# EasyEDA Pro project design.epro, schematic testing_stage1_schematic

## Sheets
1 microcontroller: Board Name: testing_stage1; Create Date: 2025-03-28; Page Name: microcontroller; Project Name: macropad-final; Schematic Name: testing_stage1_schematic; Update Date: 2025-04-02; Company: EasyEDA.com; Page Size: A4; Version: V1.0
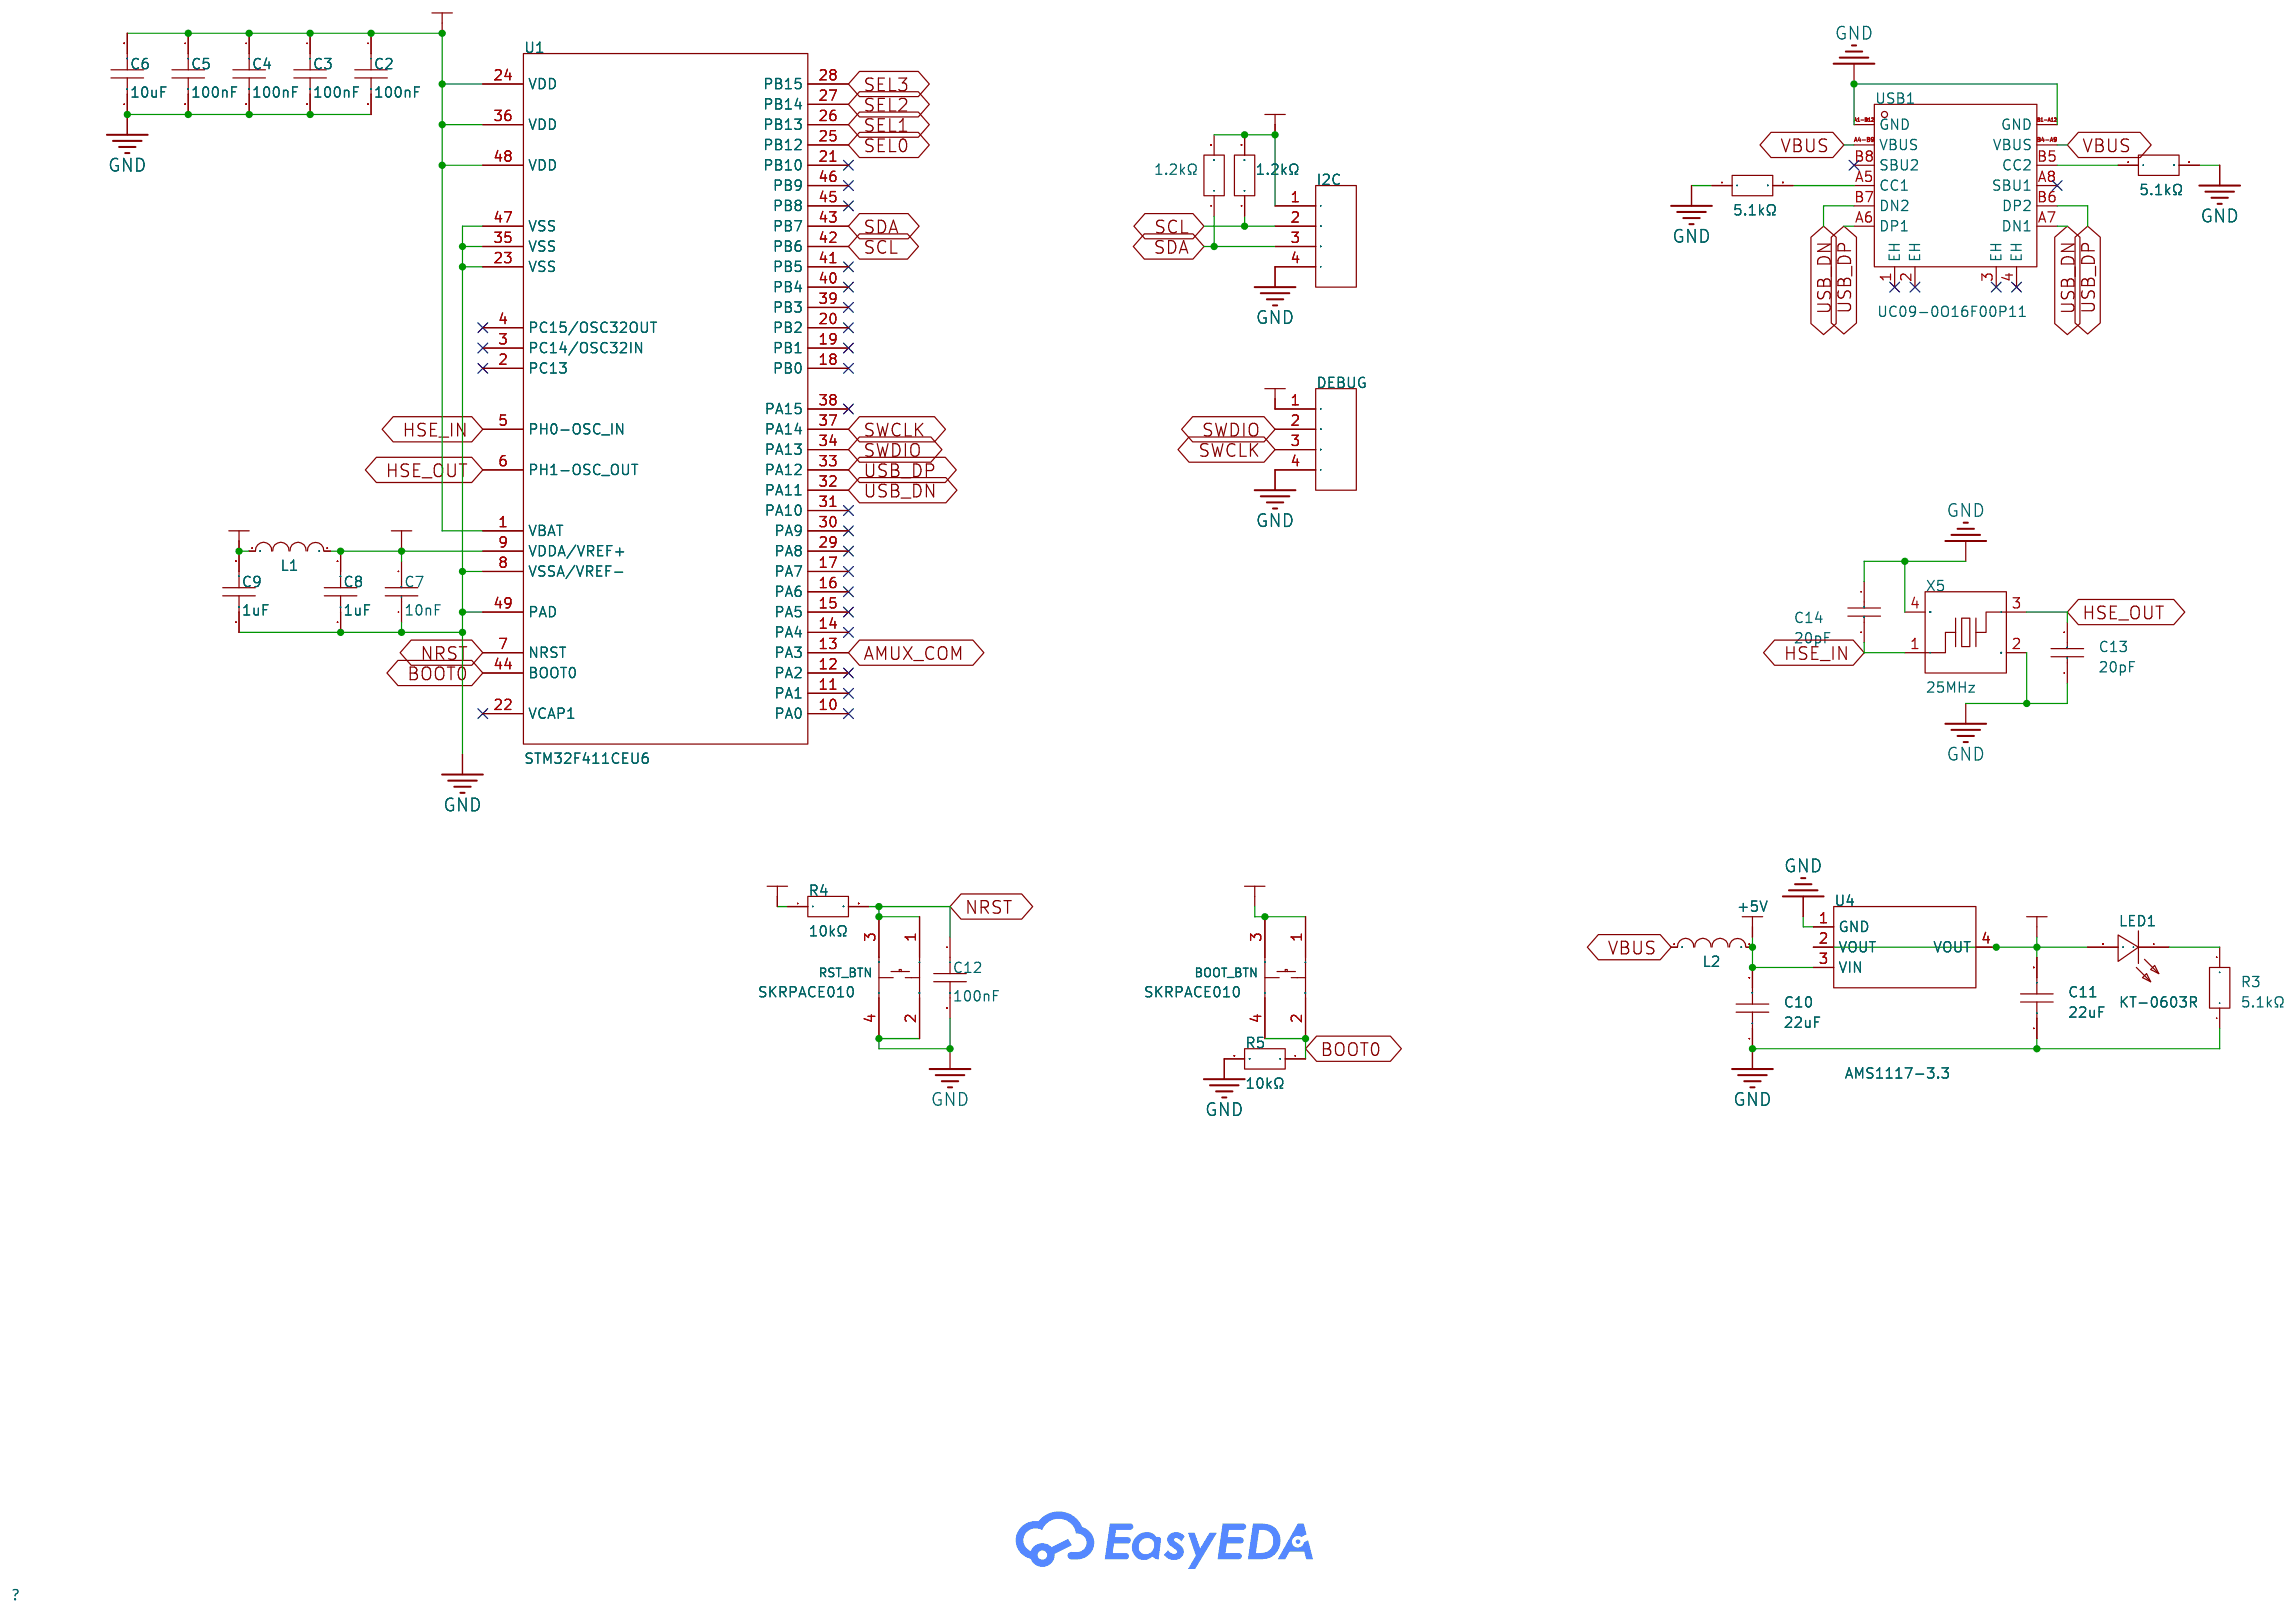
[diagram p9: microcontroller]
2 buttons: Page Name: buttons; Update Date: 2025-03-29
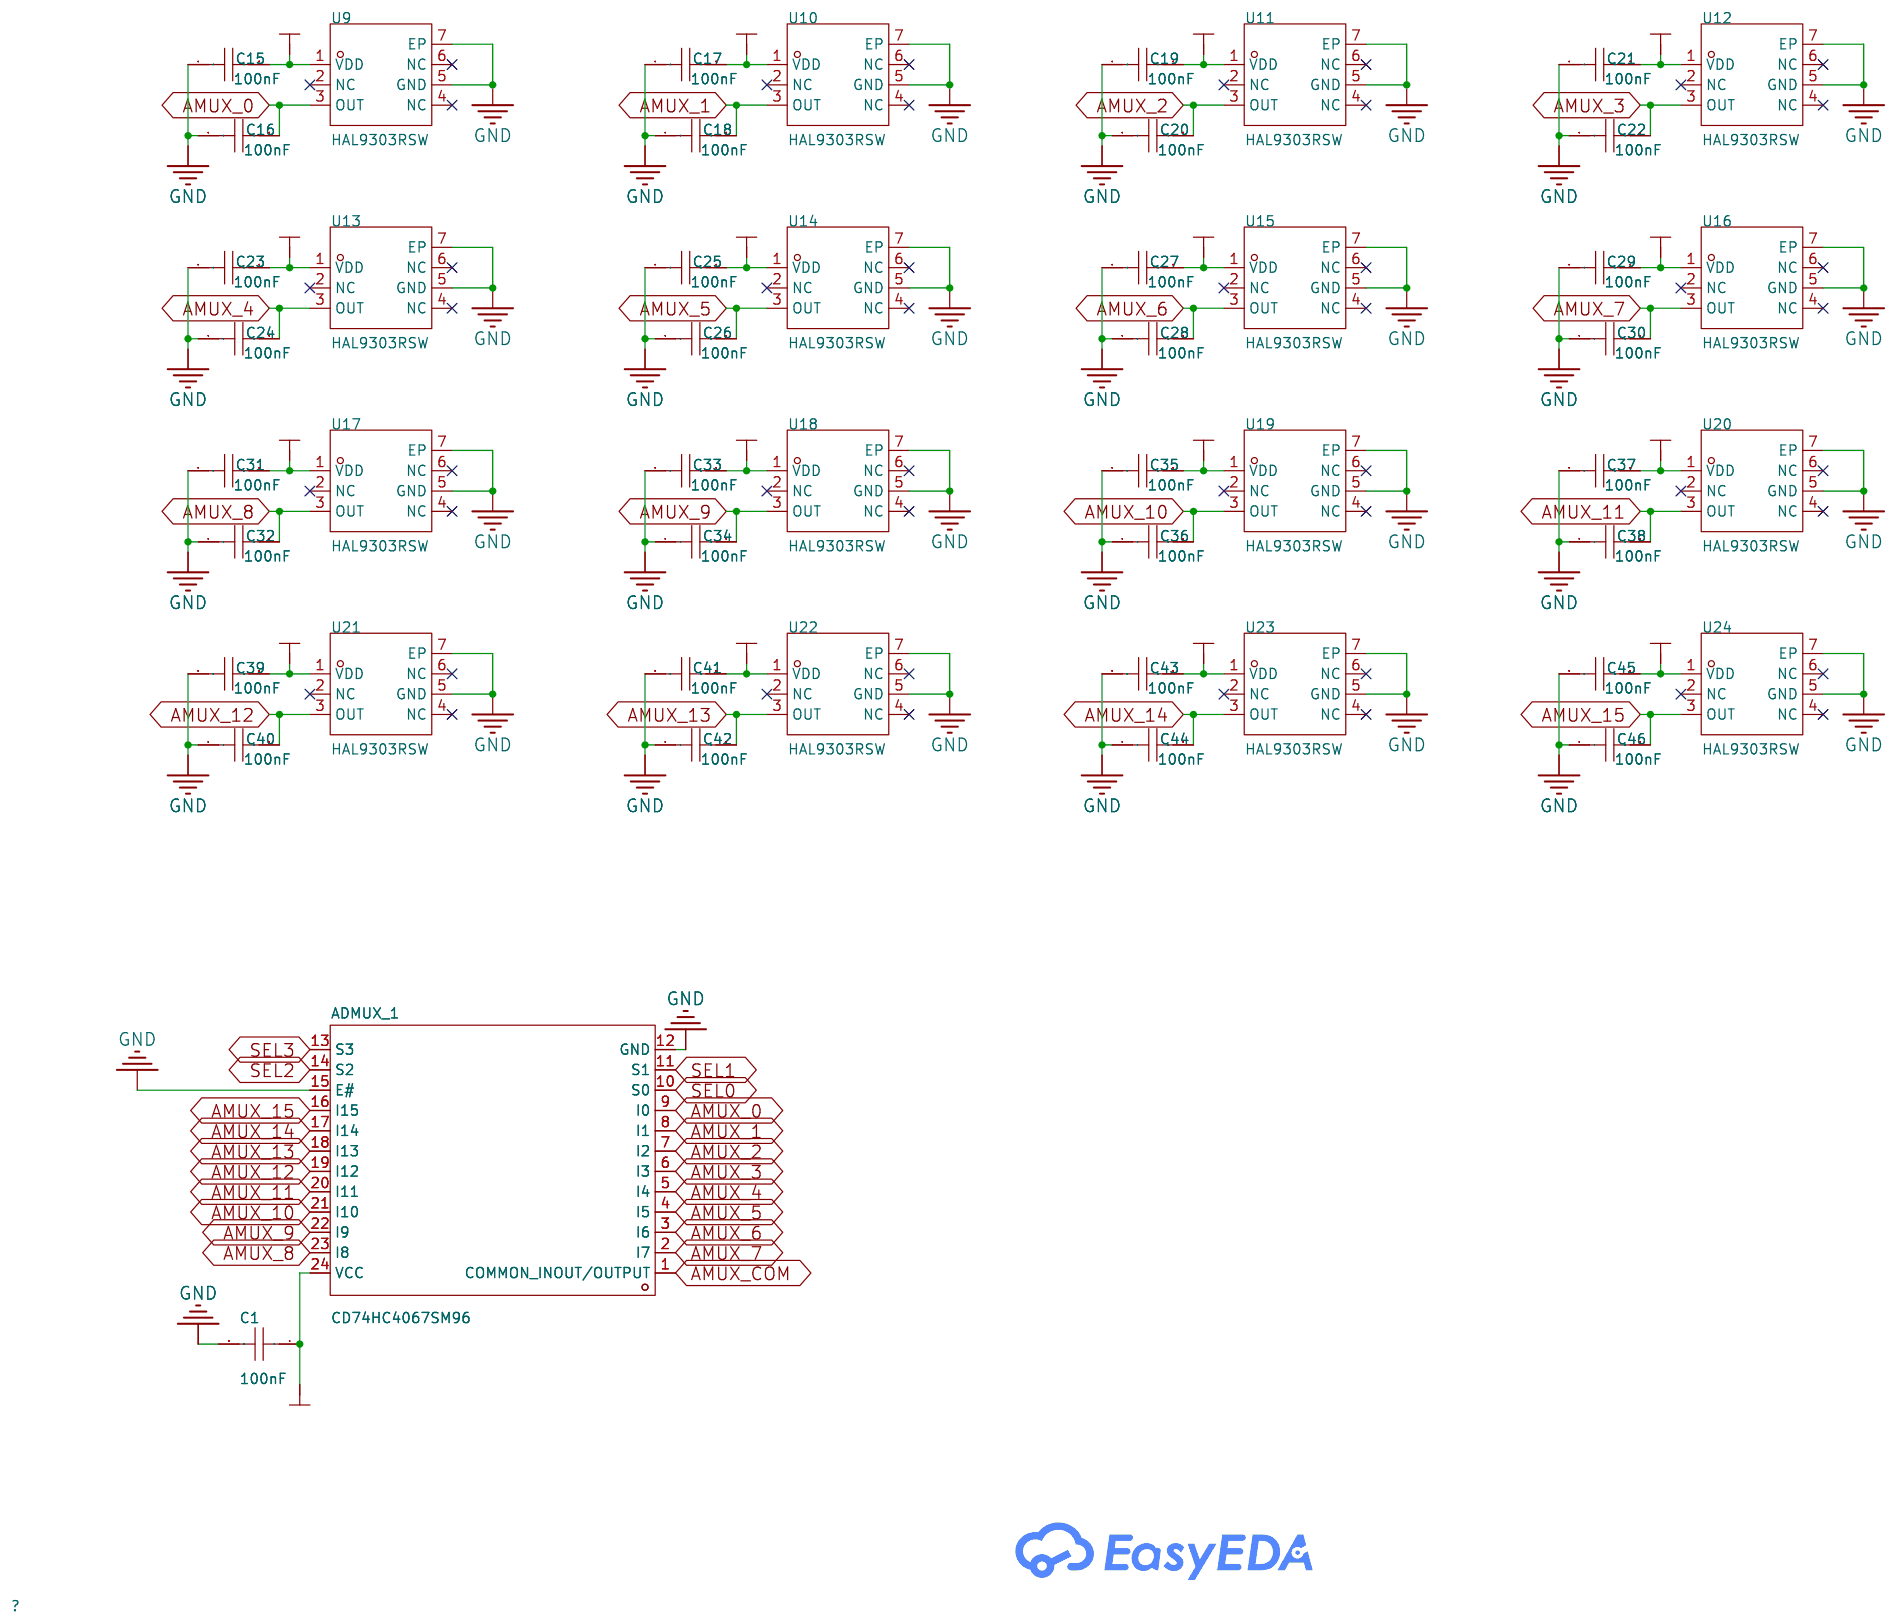
[diagram p10: buttons]

## Parts
sheet buttons
ADMUX_1  CD74HC4067SM96  [SSOP-24_L8.1-W5.3-P0.65-LS7.8-BL]
C1  100nF  [C0201]
C15  100nF  [C0201]
C16  100nF  [C0201]
C17  100nF  [C0201]
C18  100nF  [C0201]
C19  100nF  [C0201]
C20  100nF  [C0201]
C21  100nF  [C0201]
C22  100nF  [C0201]
C23  100nF  [C0201]
C24  100nF  [C0201]
C25  100nF  [C0201]
C26  100nF  [C0201]
C27  100nF  [C0201]
C28  100nF  [C0201]
C29  100nF  [C0201]
C30  100nF  [C0201]
C31  100nF  [C0201]
C32  100nF  [C0201]
C33  100nF  [C0201]
C34  100nF  [C0201]
C35  100nF  [C0201]
C36  100nF  [C0201]
C37  100nF  [C0201]
C38  100nF  [C0201]
C39  100nF  [C0201]
C40  100nF  [C0201]
C41  100nF  [C0201]
C42  100nF  [C0201]
C43  100nF  [C0201]
C44  100nF  [C0201]
C45  100nF  [C0201]
C46  100nF  [C0201]
U9  HAL9303RSW  [DFN1616-6_L1.6-W1.6-P0.50-BL-EP_RICOH_RP500X]
U10  HAL9303RSW  [DFN1616-6_L1.6-W1.6-P0.50-BL-EP_RICOH_RP500X]
U11  HAL9303RSW  [DFN1616-6_L1.6-W1.6-P0.50-BL-EP_RICOH_RP500X]
U12  HAL9303RSW  [DFN1616-6_L1.6-W1.6-P0.50-BL-EP_RICOH_RP500X]
U13  HAL9303RSW  [DFN1616-6_L1.6-W1.6-P0.50-BL-EP_RICOH_RP500X]
U14  HAL9303RSW  [DFN1616-6_L1.6-W1.6-P0.50-BL-EP_RICOH_RP500X]
U15  HAL9303RSW  [DFN1616-6_L1.6-W1.6-P0.50-BL-EP_RICOH_RP500X]
U16  HAL9303RSW  [DFN1616-6_L1.6-W1.6-P0.50-BL-EP_RICOH_RP500X]
U17  HAL9303RSW  [DFN1616-6_L1.6-W1.6-P0.50-BL-EP_RICOH_RP500X]
U18  HAL9303RSW  [DFN1616-6_L1.6-W1.6-P0.50-BL-EP_RICOH_RP500X]
U19  HAL9303RSW  [DFN1616-6_L1.6-W1.6-P0.50-BL-EP_RICOH_RP500X]
U20  HAL9303RSW  [DFN1616-6_L1.6-W1.6-P0.50-BL-EP_RICOH_RP500X]
U21  HAL9303RSW  [DFN1616-6_L1.6-W1.6-P0.50-BL-EP_RICOH_RP500X]
U22  HAL9303RSW  [DFN1616-6_L1.6-W1.6-P0.50-BL-EP_RICOH_RP500X]
U23  HAL9303RSW  [DFN1616-6_L1.6-W1.6-P0.50-BL-EP_RICOH_RP500X]
U24  HAL9303RSW  [DFN1616-6_L1.6-W1.6-P0.50-BL-EP_RICOH_RP500X]
sheet microcontroller
BOOT_BTN  SKRPACE010  [KEY-SMD_4P-L4.2-W3.2-P2.20-LS4.6]
C2  100nF  [C0201]
C3  100nF  [C0201]
C4  100nF  [C0201]
C5  100nF  [C0201]
C6  10uF  [C1206]
C7  10nF  [C0402]
C8  1uF  [C0402]
C9  1uF  [C0402]
C10  22uF  [C1206]
C11  22uF  [C1206]
C12  100nF  [C0201]
C13  20pF  [C0402]
C14  20pF  [C0402]
DEBUG  -  [4 Pin Header]  (no BOM)
I2C  -  [4 Pin Header]  (no BOM)
L1  BLM18AG121SN1D  [L0603]
L2  BLM18AG121SN1D  [L0603]
LED1  KT-0603R  [LED0603-RD]
R1  5.1kΩ  [R0402]
R2  5.1kΩ  [R0402]
R3  5.1kΩ  [R0402]
R4  10kΩ  [R0805]
R5  10kΩ  [R0805]
R6  1.2kΩ  [R0201]
R7  1.2kΩ  [R0201]
RST_BTN  SKRPACE010  [KEY-SMD_4P-L4.2-W3.2-P2.20-LS4.6]
U1  STM32F411CEU6  [UFQFPN-48_L7.0-W7.0-P0.50-BL-EP]
U4  AMS1117-3.3  [SOT-223-3_L6.5-W3.4-P2.30-LS7.0-BR]
USB1  UC09-0O16F00P11  [USB-C-SMD_UC09-0O16F00P11]
X5  25MHz  [CRYSTAL-SMD_4P-L3.2-W2.5-BL]

## Library data of the parts
ADMUX_1 = CD74HC4067SM96: Switch Circuit:- Number of Channels:16 Supply Voltage:2V~6V Supply Voltage:2V~6V Turn-on time:90ns On-State Resistance (Max):240Ω Turn-off time:87ns Operating Temperature:-55℃~+125℃ Operating Temperature:-55℃~+125℃; LCSC Part Name: 高速CMOS逻辑16通道模拟多路复用器/解复用器; Supplier Part: C98457; Manufacturer: TI(德州仪器); Supplier Footprint: SSOP-24-208mil; JLCPCB Part Class: Extended Part; Datasheet: https://www.ti.com/cn/lit/gpn/cd74hc4067; Supplier: LCSC; Number of Channels: 16; Supply Voltage: 2V~6V; Turn-on time: 90ns; On-State Resistance (Max): 240Ω; Turn-off time: 87ns; Operating Temperature: -55℃~+125℃
C1-C5 C12 C15-C46 = TCC0201X7R104K160ZT: Capacitance:100nF Tolerance:±10% Tolerance:±10% Voltage Rating:16V Temperature Coefficient:X7R; LCSC Part Name: 100nF ±10% 16V; Supplier Part: C18164586; Manufacturer: CCTC(三环); Supplier Footprint: 0201; JLCPCB Part Class: Extended Part; Datasheet: https://atta.szlcsc.com/upload/public/pdf/source/20191203/C466239_F62A586702D44EEA1C39B32FC8662B21.pdf; Supplier: LCSC; Tolerance: ±10%; Voltage Rating: 16V; Temperature Coefficient: X7R
U9-U24 = HAL9303RSW: Type:- supply voltage:- supply voltage:-; Supplier Part: C42387472; Manufacturer: Hallwee(霍尔微电子); Supplier Footprint: DFN-6-EP(1.6x1.6); Datasheet: https://atta.szlcsc.com/upload/public/pdf/source/20241128/4D6AE4F8742D3C17AD5884A18EBEC5A8.pdf; Supplier: LCSC
BOOT_BTN RST_BTN = SKRPACE010: Circuit:SPST Actuator Style:Oval button Mounting Style:Brick nogging Switch Length:4.2mm Switch Width:3.2mm Switch Height:2.5mm Contact Current:50mA Voltage Rating (DC):16V With Lamp:- Mechanical Life:-; LCSC Part Name: 4.2*3.2*2.5mm 立贴 轻触开关; Supplier Part: C139797; Manufacturer: ALPSALPINE(阿尔卑斯阿尔派); Supplier Footprint: SMD; JLCPCB Part Class: Extended Part; Datasheet: https://atta.szlcsc.com/upload/public/pdf/source/20171113/C139797_15105612676371115729.pdf; Supplier: LCSC; Circuit: SPST; Actuator Style: Oval button; Mounting Style: Brick nogging; Switch Length: 4.2mm; Switch Width: 3.2mm; Switch Height: 2.5mm; Contact Current: 50mA; Voltage Rating (DC): 16V
C6 = HGC1206R7106K350NSPJ: Capacitance:10uF Tolerance:±10% Tolerance:±10% Voltage Rating:35V Temperature Coefficient:X7R; LCSC Part Name: 10uF ±10% 35V; Supplier Part: C33546014; Manufacturer: Chinocera(华瓷); Supplier Footprint: 1206; JLCPCB Part Class: Extended Part; Datasheet: https://atta.szlcsc.com/upload/public/pdf/source/20240724/7749F3690BCC21BF5565A9D339ADF00C.pdf; Supplier: LCSC; Tolerance: ±10%; Voltage Rating: 35V; Temperature Coefficient: X7R
C7 = 0402B103K500NT: Capacitance:10nF Tolerance:±10% Tolerance:±10% Voltage Rating:50V Temperature Coefficient:X7R; LCSC Part Name: 10nF ±10% 50V; Supplier Part: C1524; Manufacturer: FH(风华); Supplier Footprint: 0402; JLCPCB Part Class: Extended Part; Datasheet: https://atta.szlcsc.com/upload/public/pdf/source/20200305/C486355_26A10D38EF8C2A5C37091D0039909270.pdf; Supplier: LCSC; Tolerance: ±10%; Voltage Rating: 50V; Temperature Coefficient: X7R
C8 C9 = TCC0402X5R105K500AT: Capacitance:1uF Tolerance:±10% Tolerance:±10% Voltage Rating:50V Temperature Coefficient:X5R; LCSC Part Name: 1uF ±10% 50V; Supplier Part: C20539426; Manufacturer: CCTC(三环); Supplier Footprint: 0402; JLCPCB Part Class: Extended Part; Datasheet: https://atta.szlcsc.com/upload/public/pdf/source/20191203/C466239_F62A586702D44EEA1C39B32FC8662B21.pdf; Supplier: LCSC; Tolerance: ±10%; Voltage Rating: 50V; Temperature Coefficient: X5R
C10 C11 = TCC1206X7R226K160HT: Capacitance:22uF Tolerance:±10% Tolerance:±10% Voltage Rating:16V Temperature Coefficient:X7R; LCSC Part Name: 22uF ±10% 16V; Supplier Part: C22392398; Manufacturer: CCTC(三环); Supplier Footprint: 1206; JLCPCB Part Class: Extended Part; Datasheet: https://atta.szlcsc.com/upload/public/pdf/source/20191203/C466239_F62A586702D44EEA1C39B32FC8662B21.pdf; Supplier: LCSC; Tolerance: ±10%; Voltage Rating: 16V; Temperature Coefficient: X7R
C13 C14 = 0402CG200J500NT: Capacitance: Tolerance:±5% Tolerance:±5% Voltage Rated: Temperature Coefficient:; LCSC Part Name: 20pF ±5% 50V; Supplier Part: C1554; Manufacturer: FH(风华); Supplier Footprint: 0402; JLCPCB Part Class: Basic Part; Datasheet: https://atta.szlcsc.com/upload/public/pdf/source/20200305/C486355_26A10D38EF8C2A5C37091D0039909270.pdf; Supplier: LCSC; Tolerance: ±5%
DEBUG I2C = 4 Pin Header
L1 L2 = BLM18AG121SN1D: Impedance @ Frequency:120Ω@100MHz Tolerance:±25% Tolerance:±25% DC Resistance:180mΩ Current Rating:800mA Circuits:1; LCSC Part Name: 单路 0603磁珠 阻抗120Ω@100MHz; Supplier Part: C76892; Manufacturer: muRata(村田); Supplier Footprint: 0603; JLCPCB Part Class: Extended Part; Datasheet: https://atta.szlcsc.com/upload/public/pdf/source/20180329/C160981_FD3C2D2622A377E203B89F4AA32B0741.pdf; Supplier: LCSC; Impedance @ Frequency: 120Ω@100MHz; Tolerance: ±25%; DC Resistance: 180mΩ; Current Rating: 800mA; Circuits: 1
LED1 = KT-0603R: Emitted Color:Red Power Dissipation:- Forward Current:- Dominant Wavelength:- Dominant Wavelength:- Peak Wavelength:- Diode Configuration:- Lens Color:- Color Temperature:- Color Temperature:- Viewing Angle:- Mounting Sytle:- Operating Temperature:-40℃~+8; LCSC Part Name: 0603 红灯 高亮; Supplier Part: C2286; Manufacturer: KENTO; Supplier Footprint: 0603; JLCPCB Part Class: Basic Part; Datasheet: https://atta.szlcsc.com/upload/public/pdf/source/20160616/1466072038404.pdf; Supplier: LCSC; Emitted Color: Red; Operating Temperature: -40℃~+85℃
R1-R3 = FRC0402J512 TS: Type:Thick Film Resistors Resistance:5.1kΩ Tolerance:±5% Tolerance:±5% Power(Watts):1/16W Voltage-Supply(Max):50V Temperature Coefficient:±100ppm/℃ Temperature Coefficient:±100ppm/℃ Operating Temperature:-55℃~+155℃ Operating Temperature:-55℃~+155℃; LCSC Part Name: 5.1kΩ ±5% 62.5mW 厚膜电阻; Supplier Part: C2906948; Manufacturer: FOJAN(富捷); Supplier Footprint: 0402; JLCPCB Part Class: Extended Part; Datasheet: https://atta.szlcsc.com/upload/public/pdf/source/20211221/925EC7D7225764EE0046F22065062C87.pdf; Supplier: LCSC; Type: Thick Film Resistors; Tolerance: ±5%; Power(Watts): 1/16W; Voltage-Supply(Max): 50V; Temperature Coefficient: ±100ppm/℃; Operating Temperature: -55℃~+155℃
R4 R5 = HoAR0805-1/8W-10KR-1%-TCR25: Type:Ceramic resistor Resistance:10kΩ Tolerance:±1% Tolerance:±1% Power(Watts):1/8W Temperature Coefficient:±25ppm/℃ Temperature Coefficient:±25ppm/℃; LCSC Part Name: 陶瓷电阻 10kΩ ±1% 125mW; Supplier Part: C5123591; Manufacturer: Milliohm(毫欧); Supplier Footprint: 0805; JLCPCB Part Class: Extended Part; Datasheet: https://atta.szlcsc.com/upload/public/pdf/source/20220805/6A845D963435C707E89C4EB374FF6A6C.pdf; Supplier: LCSC; Type: Ceramic resistor; Tolerance: ±1%; Power(Watts): 1/8W; Temperature Coefficient: ±25ppm/℃
R6 R7 = AC0201FR-071K2L: Type:Thick Film Resistors Resistance:1.2kΩ Tolerance:±1% Tolerance:±1% Power(Watts):50mW Voltage-Supply(Max):25V Temperature Coefficient:±200ppm/℃ Temperature Coefficient:±200ppm/℃ Operating Temperature:-55℃~+155℃ Operating Temperature:-55℃~+155℃; LCSC Part Name: 厚膜电阻 1.2kΩ ±1% 50mW; Supplier Part: C226448; Manufacturer: YAGEO(国巨); Supplier Footprint: 0201; JLCPCB Part Class: Extended Part; Datasheet: https://atta.szlcsc.com/upload/public/pdf/source/20211117/A6A0BDAE103E877571F8FBA448670DE2.pdf; Supplier: LCSC; Type: Thick Film Resistors; Tolerance: ±1%; Power(Watts): 50mW; Voltage-Supply(Max): 25V; Temperature Coefficient: ±200ppm/℃; Operating Temperature: -55℃~+155℃
U1 = STM32F411CEU6: CPU Core:ARM-M4 CPU Maximum Speed:100MHz Program Storage Size:512KB Program Memory Type:FLASH Number of I/O:36 ADC (Bit):12bit Low Voltage Detection Threshold:1.7V~3.6V Low Voltage Detection Threshold:1.7V~3.6V Application Area:-; LCSC Part Name: 带DSP和FPU的高性能基本型系列ARM Cortex-M4 MCU，具有512 KB Flash、100 MHz CPU和ART加速器; Supplier Part: C60420; Manufacturer: ST(意法半导体); Supplier Footprint: UFQFPN-48(7x7); JLCPCB Part Class: Extended Part; Datasheet: https://atta.szlcsc.com/upload/public/pdf/source/20151026/1457707507170.pdf; Supplier: LCSC; CPU Core: ARM-M4; CPU Maximum Speed: 100MHz; Program Storage Size: 512KB; Program Memory Type: FLASH; Number of I/O: 36; ADC (Bit): 12bit; Low Voltage Detection Threshold: 1.7V~3.6V
U4 = AMS1117-3.3_C6186: Output Type:Fixed Voltage - Supply:- Output Voltage:3.3V Output Voltage:3.3V Output Current:1A Power Supply Rejection Ratio (PSRR):72dB@(120Hz) Voltage Dropout:1.3V@(800mA) standby current:- Noise:- Features:Overcurrent Protection(OCP)；热关断(TSD) Operating; LCSC Part Name: 输出3.3V 1A; Supplier Part: C6186; Manufacturer: AMS; Supplier Footprint: SOT-223; JLCPCB Part Class: Basic Part; Datasheet: https://atta.szlcsc.com/upload/public/pdf/source/20180727/C6186_7A095716F0823C02F1997A905E26C086.pdf; Supplier: LCSC; Output Type: Fixed; Output Voltage: 3.3V; Output Current: 1A; Power Supply Rejection Ratio (PSRR): 72dB@(120Hz); Voltage Dropout: 1.3V@(800mA); Features: Overcurrent Protection(OCP)；热关断(TSD); Output Configuration: Positive electrode; Number of Outputs: 1
USB1 = UC09-0O16F00P11: Connector Type:Type-C Gender:Female Mounting Type:Horizontal attachment Number of Contacts:16P Number of Ports:1 Current Rating-Power:3A; LCSC Part Name: USB Type-C 母座 卧贴; Supplier Part: C36936541; Manufacturer: BXCONN(宝讯); Supplier Footprint: SMD; JLCPCB Part Class: Extended Part; Datasheet: https://atta.szlcsc.com/upload/public/pdf/source/20240731/591155F6664C57552DC307035301A7C8.pdf; Supplier: LCSC; Connector Type: Type-C; Gender: Female; Mounting Type: Horizontal attachment; Number of Contacts: 16P; Number of Ports: 1; Current Rating-Power: 3A
X5 = S3225000271060C3: Type:Surface Mount Crystal Frequency:25MHz Normal temperature Frequency Tolerance:±10ppm Normal temperature Frequency Tolerance:±10ppm Load Capacitance:27pF Frequency Stability:±30ppm Frequency Stability:±30ppm Equivalent Series Resistance(ESR):60Ω Operat; LCSC Part Name: 25MHz ±10ppm 27pF; Supplier Part: C5380610; Manufacturer: JGHC(晶光华); Supplier Footprint: SMD3225-4P; JLCPCB Part Class: Extended Part; Datasheet: https://atta.szlcsc.com/upload/public/pdf/source/20241029/60EE57D51513354C612A10EC3AE04C53.pdf; Supplier: LCSC; Type: Surface Mount Crystal; Normal temperature Frequency Tolerance: ±10ppm; Load Capacitance: 27pF; Frequency Stability: ±30ppm; Equivalent Series Resistance(ESR): 60Ω; Operating Temperature: -40℃~+85℃

## Nets
+3.3V: ADMUX_1.24(VCC) BOOT_BTN.1 BOOT_BTN.3 C1.1 C2.1 C3.1 C4.1 C5.1 C6.2 C9.2 C11.2 C15.2 C17.2 C19.2 C21.2 C23.2 C25.2 C27.2 C29.2 C31.2 C33.2 C35.2 C37.2 C39.2 C41.2 C43.2 C45.2 DEBUG.1 I2C.1 L1.1 LED1.2(A) R4.1 R6.2 R7.2 U1.1(VBAT) U1.24(VDD) U1.36(VDD) U1.48(VDD) U4.2(VOUT) U4.4(VOUT) U9.1(VDD) U10.1(VDD) U11.1(VDD) U12.1(VDD) U13.1(VDD) U14.1(VDD) U15.1(VDD) U16.1(VDD) U17.1(VDD) U18.1(VDD) U19.1(VDD) U20.1(VDD) U21.1(VDD) U22.1(VDD) U23.1(VDD) U24.1(VDD)
+3.3VA: C7.2 C8.2 L1.2 U1.9(VDDA/VREF+)
+5V: C10.2 L2.2 U4.3(VIN)
GND: ADMUX_1.12(GND) ADMUX_1.15(E#) C1.2 C2.2 C3.2 C4.2 C5.2 C6.1 C7.1 C8.1 C9.1 C10.1 C11.1 C12.2 C13.1 C14.1 C15.1 C16.1 C17.1 C18.1 C19.1 C20.1 C21.1 C22.1 C23.1 C24.1 C25.1 C26.1 C27.1 C28.1 C29.1 C30.1 C31.1 C32.1 C33.1 C34.1 C35.1 C36.1 C37.1 C38.1 C39.1 C40.1 C41.1 C42.1 C43.1 C44.1 C45.1 C46.1 DEBUG.4 I2C.4 R1.1 R2.2 R3.1 R5.2 RST_BTN.2 RST_BTN.4 U1.8(VSSA/VREF-) U1.23(VSS) U1.35(VSS) U1.47(VSS) U1.49(PAD) U4.1(GND) U9.5(GND) U9.7(EP) U10.5(GND) U10.7(EP) U11.5(GND) U11.7(EP) U12.5(GND) U12.7(EP) U13.5(GND) U13.7(EP) U14.5(GND) U14.7(EP) U15.5(GND) U15.7(EP) U16.5(GND) U16.7(EP) U17.5(GND) U17.7(EP) U18.5(GND) U18.7(EP) U19.5(GND) U19.7(EP) U20.5(GND) U20.7(EP) U21.5(GND) U21.7(EP) U22.5(GND) U22.7(EP) U23.5(GND) U23.7(EP) U24.5(GND) U24.7(EP) USB1.A1-B12(GND) USB1.B1-A12(GND) X5.2(GND) X5.4(GND)
VBUS: L2.1 USB1.A4-B9(VBUS) USB1.B4-A9(VBUS)
AMUX_0: ADMUX_1.9(I0) C16.2 U9.3(OUT)
AMUX_1: ADMUX_1.8(I1) C18.2 U10.3(OUT)
AMUX_2: ADMUX_1.7(I2) C20.2 U11.3(OUT)
AMUX_3: ADMUX_1.6(I3) C22.2 U12.3(OUT)
AMUX_4: ADMUX_1.5(I4) C24.2 U13.3(OUT)
AMUX_5: ADMUX_1.4(I5) C26.2 U14.3(OUT)
AMUX_6: ADMUX_1.3(I6) C28.2 U15.3(OUT)
AMUX_7: ADMUX_1.2(I7) C30.2 U16.3(OUT)
AMUX_8: ADMUX_1.23(I8) C32.2 U17.3(OUT)
AMUX_9: ADMUX_1.22(I9) C34.2 U18.3(OUT)
AMUX_10: ADMUX_1.21(I10) C36.2 U19.3(OUT)
AMUX_11: ADMUX_1.20(I11) C38.2 U20.3(OUT)
AMUX_12: ADMUX_1.19(I12) C40.2 U21.3(OUT)
AMUX_13: ADMUX_1.18(I13) C42.2 U22.3(OUT)
AMUX_14: ADMUX_1.17(I14) C44.2 U23.3(OUT)
AMUX_15: ADMUX_1.16(I15) C46.2 U24.3(OUT)
AMUX_COM: ADMUX_1.1(COMMON INOUT/OUTPUT) U1.13(PA3)
BOOT0: BOOT_BTN.2 BOOT_BTN.4 R5.1 U1.44(BOOT0)
HSE_IN: C14.2 U1.5(PH0-OSC_IN) X5.1
HSE_OUT: C13.2 U1.6(PH1-OSC_OUT) X5.3
NRST: C12.1 R4.2 RST_BTN.1 RST_BTN.3 U1.7(NRST)
SCL: I2C.2 R6.1 U1.42(PB6)
SDA: I2C.3 R7.1 U1.43(PB7)
SEL0: ADMUX_1.10(S0) U1.25(PB12)
SEL1: ADMUX_1.11(S1) U1.26(PB13)
SEL2: ADMUX_1.14(S2) U1.27(PB14)
SEL3: ADMUX_1.13(S3) U1.28(PB15)
SWCLK: DEBUG.3 U1.37(PA14)
SWDIO: DEBUG.2 U1.34(PA13)
USB_DN: U1.32(PA11) USB1.A7(DN1) USB1.B7(DN2)
USB_DP: U1.33(PA12) USB1.A6(DP1) USB1.B6(DP2)
$1N3487: R1.2 USB1.A5(CC1)
$1N3526: R2.1 USB1.B5(CC2)
$1N4144: LED1.1(K) R3.2

Not connected (* = marked no-connect by the designer): U1 2(PC13)* 3(PC14/OSC32IN)* 4(PC15/OSC32OUT)* 10(PA0)* 11(PA1)* 12(PA2)* 14(PA4)* 15(PA5)* 16(PA6)* 17(PA7)* 18(PB0)* 19(PB1)* 20(PB2)* 21(PB10)* 22(VCAP1)* 29(PA8)* 30(PA9)* 31(PA10)* 38(PA15)* 39(PB3)* 40(PB4)* 41(PB5)* 45(PB8)* 46(PB9)*; U9 2(NC)* 4(NC)* 6(NC)*; U10 2(NC)* 4(NC)* 6(NC)*; U11 2(NC)* 4(NC)* 6(NC)*; U12 2(NC)* 4(NC)* 6(NC)*; U13 2(NC)* 4(NC)* 6(NC)*; U14 2(NC)* 4(NC)* 6(NC)*; U15 2(NC)* 4(NC)* 6(NC)*; U16 2(NC)* 4(NC)* 6(NC)*; U17 2(NC)* 4(NC)* 6(NC)*; U18 2(NC)* 4(NC)* 6(NC)*; U19 2(NC)* 4(NC)* 6(NC)*; U20 2(NC)* 4(NC)* 6(NC)*; U21 2(NC)* 4(NC)* 6(NC)*; U22 2(NC)* 4(NC)* 6(NC)*; U23 2(NC)* 4(NC)* 6(NC)*; U24 2(NC)* 4(NC)* 6(NC)*; USB1 1(EH)* 2(EH)* 3(EH)* 4(EH)* A8(SBU1)* B8(SBU2)*
